# EAGLE design untitled (EAGLE 6.1)
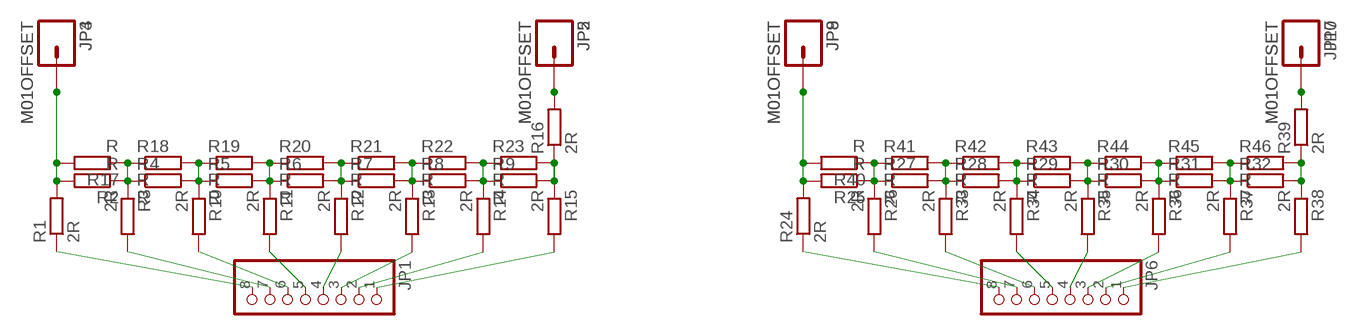
[diagram p0: schematic, sheet 1]

## Parts
JP1  PINHD-1X8/90  [1X08/90]
JP2  M01OFFSET  [1X01_OFFSET]
JP3  M01OFFSET  [1X01_OFFSET]
JP4  M01OFFSET  [1X01_OFFSET]
JP5  M01OFFSET  [1X01_OFFSET]
JP6  PINHD-1X8/90  [1X08/90]
JP7  M01OFFSET  [1X01_OFFSET]
JP8  M01OFFSET  [1X01_OFFSET]
JP9  M01OFFSET  [1X01_OFFSET]
JP10  M01OFFSET  [1X01_OFFSET]
R1  2R  R-EU_M0805  [M0805]
R2  R  R-EU_M0805  [M0805]
R3  2R  R-EU_M0805  [M0805]
R4  R  R-EU_M0805  [M0805]
R5  R  R-EU_M0805  [M0805]
R6  R  R-EU_M0805  [M0805]
R7  R  R-EU_M0805  [M0805]
R8  R  R-EU_M0805  [M0805]
R9  R  R-EU_M0805  [M0805]
R10  2R  R-EU_M0805  [M0805]
R11  2R  R-EU_M0805  [M0805]
R12  2R  R-EU_M0805  [M0805]
R13  2R  R-EU_M0805  [M0805]
R14  2R  R-EU_M0805  [M0805]
R15  2R  R-EU_M0805  [M0805]
R16  2R  R-EU_M0805  [M0805]
R17  R  R-EU_M0805  [M0805]
R18  R  R-EU_M0805  [M0805]
R19  R  R-EU_M0805  [M0805]
R20  R  R-EU_M0805  [M0805]
R21  R  R-EU_M0805  [M0805]
R22  R  R-EU_M0805  [M0805]
R23  R  R-EU_M0805  [M0805]
R24  2R  R-EU_0204/2V  [0204V]
R25  R  R-EU_0204/2V  [0204V]
R26  2R  R-EU_0204/2V  [0204V]
R27  R  R-EU_0204/2V  [0204V]
R28  R  R-EU_0204/2V  [0204V]
R29  R  R-EU_0204/2V  [0204V]
R30  R  R-EU_0204/2V  [0204V]
R31  R  R-EU_0204/2V  [0204V]
R32  R  R-EU_0204/2V  [0204V]
R33  2R  R-EU_0204/2V  [0204V]
R34  2R  R-EU_0204/2V  [0204V]
R35  2R  R-EU_0204/2V  [0204V]
R36  2R  R-EU_0204/2V  [0204V]
R37  2R  R-EU_0204/2V  [0204V]
R38  2R  R-EU_0204/2V  [0204V]
R39  2R  R-EU_0204/2V  [0204V]
R40  R  R-EU_0204/2V  [0204V]
R41  R  R-EU_0204/2V  [0204V]
R42  R  R-EU_0204/2V  [0204V]
R43  R  R-EU_0204/2V  [0204V]
R44  R  R-EU_0204/2V  [0204V]
R45  R  R-EU_0204/2V  [0204V]
R46  R  R-EU_0204/2V  [0204V]

## Nets
N$1: R2.1 R3.1 R4.1
N$2: R4.2 R5.1 R10.1
N$3: R5.2 R6.1 R11.1
N$4: R6.2 R7.1 R12.1
N$5: R8.2 R9.1 R14.1
N$6: R7.2 R8.1 R13.1
N$7: JP3.1 JP4.1 R1.2 R2.2 R17.2
N$8: JP1.8 R1.1
N$9: JP1.7 R3.2
N$10: JP1.6 R10.2
N$11: JP1.5 R11.2
N$12: JP1.4 R12.2
N$13: JP1.3 R13.2
N$14: JP1.2 R14.2
N$15: R9.2 R15.1 R16.1
N$16: JP1.1 R15.2
N$17: JP2.1 JP5.1 R16.2
N$18: R25.1 R26.1 R27.1
N$19: R27.2 R28.1 R33.1
N$20: R28.2 R29.1 R34.1
N$21: R29.2 R30.1 R35.1
N$22: R31.2 R32.1 R37.1
N$23: R30.2 R31.1 R36.1
N$24: JP8.1 JP9.1 R24.2 R25.2 R40.2
N$25: JP6.8 R24.1
N$26: R17.1 R18.1
N$27: R18.2 R19.1
N$28: R19.2 R20.1
N$29: R20.2 R21.1
N$30: R22.2 R23.1
N$31: R21.2 R22.1
N$32: JP6.7 R26.2
N$33: R23.2
N$34: JP6.6 R33.2
N$35: JP6.5 R34.2
N$36: JP6.4 R35.2
N$37: JP6.3 R36.2
N$38: JP6.2 R37.2
N$39: R32.2 R38.1 R39.1 R46.2
N$40: JP6.1 R38.2
N$41: JP7.1 JP10.1 R39.2
N$42: R40.1 R41.1
N$43: R41.2 R42.1
N$44: R42.2 R43.1
N$45: R43.2 R44.1
N$46: R45.2 R46.1
N$47: R44.2 R45.1

## Library data of the parts
JP1 JP6 = pinhead:PINHD-1X8: PIN HEADER
JP2-JP5 JP7-JP10 = SparkFun-Connectors:M01: Header 1 Standard 1-pin 0.1" header. Use with straight break away headers (SKU : PRT-00116), right angle break away headers (PRT-00553), swiss pins (PRT-00743), machine pins (PRT-00117), and female headers (PRT-00115).
R1-R46 = rcl:R-EU_: RESISTOR, European symbol

## Board
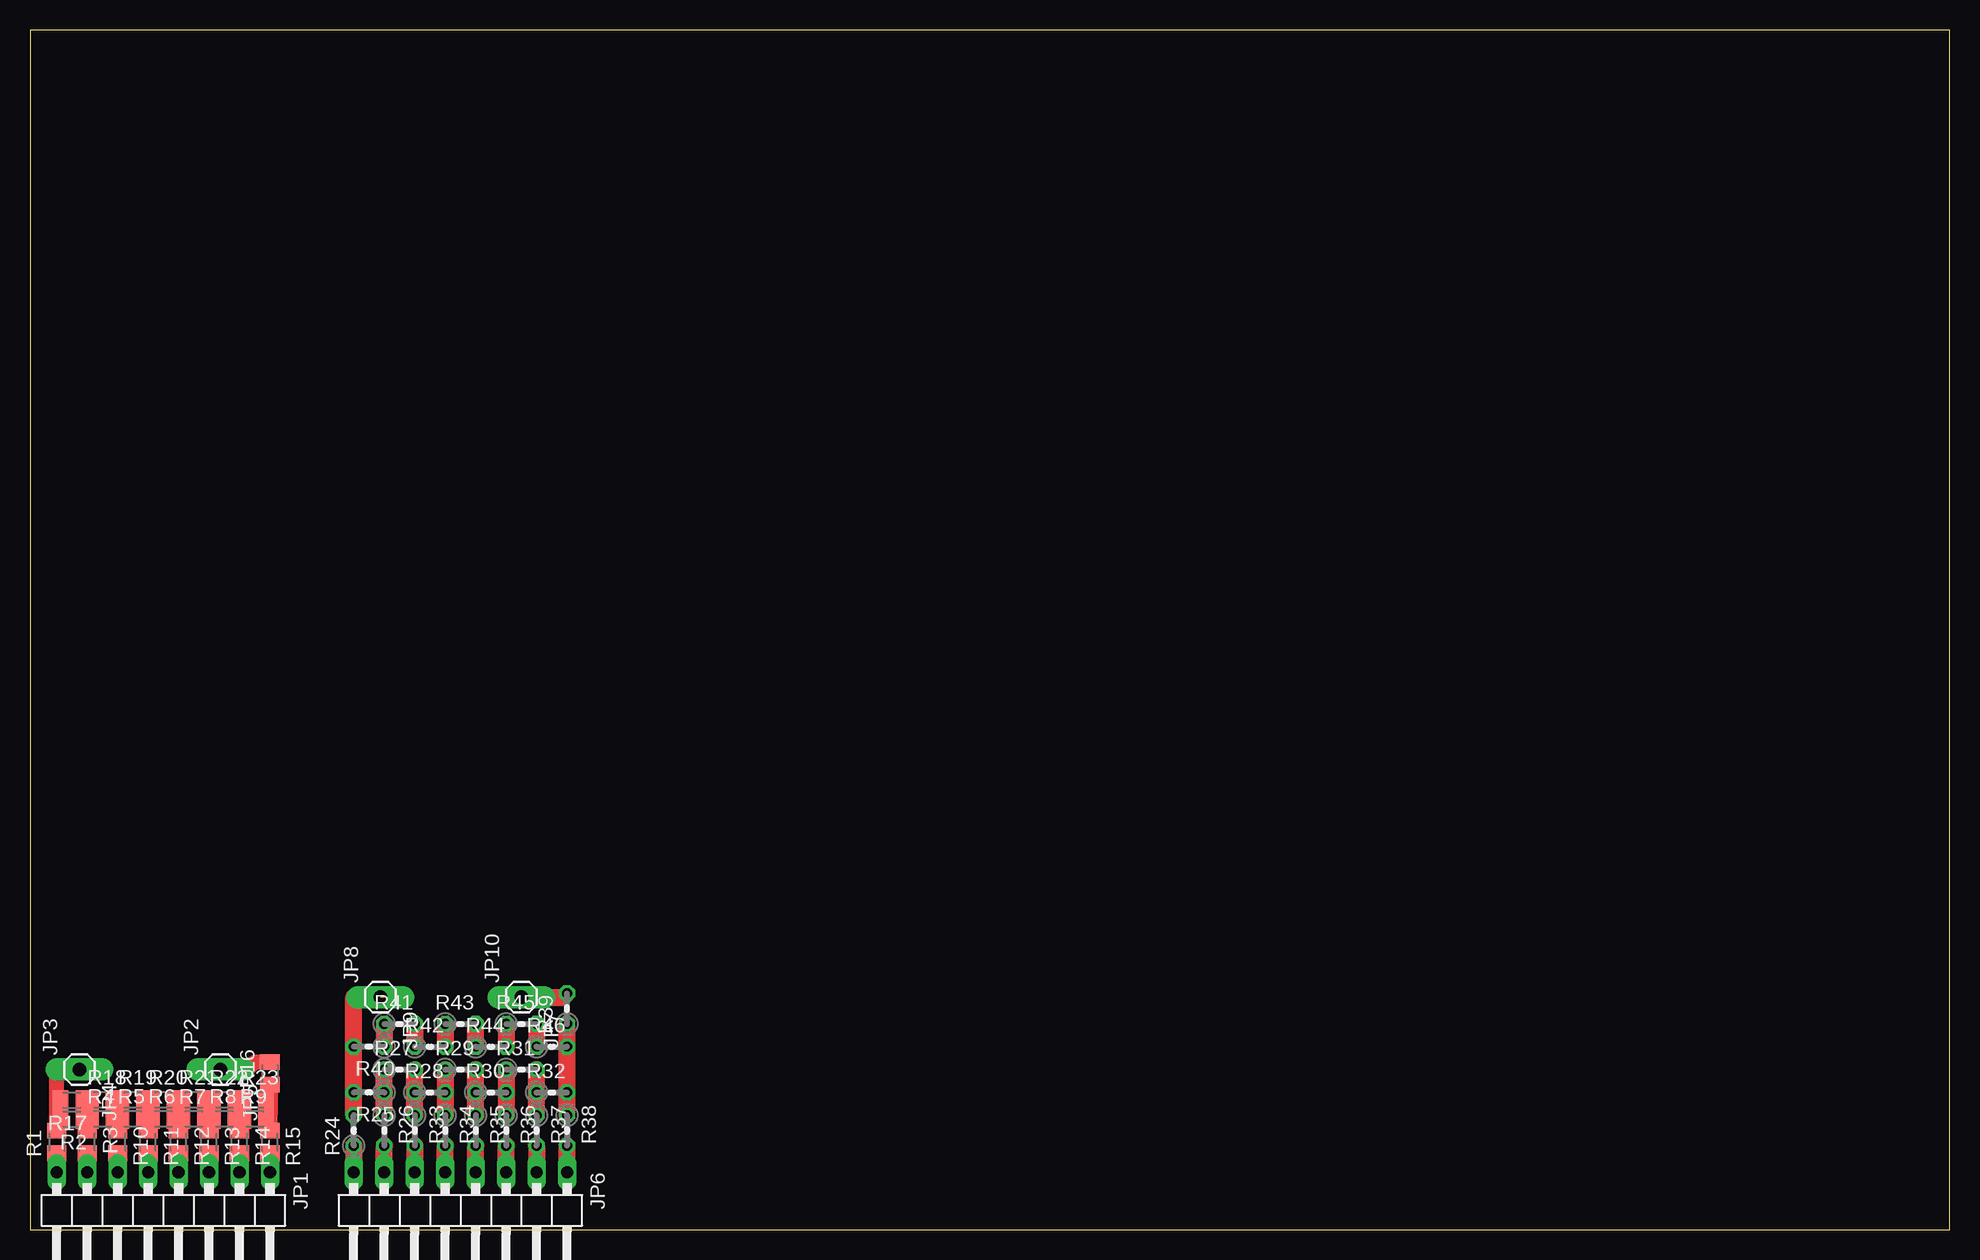
[diagram p1: board, top side]

Size 160 x 100 mm. Coordinates in mm from the lower left corner, seen from the top.
Outline: 0,0 160,0 160,100 0,100 0,0
Copper layers (1*16): Top 0.035mm / dielectric 1.5mm / Bottom 0.035mm
Design rules: minimum track width 10mil, minimum drill 24mil, track to track 8mil, track to pad 8mil, pad to pad 8mil, via to via 8mil, smd to smd 8mil, copper to edge 40mil, drill to drill 8mil, minimum pad ring 10mil, minimum via ring 8mil, stop-mask expansion 4mil, vias tented up to drill 0mil, thermal gap 10mil

### Footprints (pad centres in the part's own frame; a part is rotated, then mirrored left to right if it is on the bottom)
1X08/90 = drill 1.016 long: 1 -8.89,-3.81; 2 -6.35,-3.81; 3 -3.81,-3.81; 4 -1.27,-3.81; 5 1.27,-3.81; 6 3.81,-3.81; 7 6.35,-3.81; 8 8.89,-3.81
1X01_OFFSET = drill 1.118 pad 1.88 offset: 1 0,0
M0805 = smd 1.3 x 1.6: 1 -0.95,0; 2 0.95,0
0204V = drill 0.813 octagon: 1 -1.27,0; 2 1.27,0

### Placement (x,y rotation side)
JP1  11.11,0.95 180 top
JP2  15.88,13.34 90 top
JP3  4.13,13.34 90 top
JP4  4.13,13.34 270 top
JP5  15.88,13.34 270 top
JP6  35.88,0.95 180 top
JP7  40.96,19.37 270 top
JP8  29.21,19.37 90 top
JP9  29.21,19.37 270 top
JP10  40.96,19.37 90 top
R1  2.22,7.3 90 top
R2  3.49,9.21 180 top
R3  4.76,7.3 270 top
R4  6.03,9.21 0 top
R5  8.57,9.21 0 top
R6  11.11,9.21 0 top
R7  13.65,9.21 0 top
R8  16.19,9.21 0 top
R9  18.73,9.21 0 top
R10  7.3,7.3 270 top
R11  9.84,7.3 270 top
R12  12.38,7.3 270 top
R13  14.92,7.3 270 top
R14  17.46,7.3 270 top
R15  20,7.3 270 top
R16  20,13.02 90 top
R17  3.49,10.79 180 top
R18  6.03,10.79 0 top
R19  8.57,10.79 0 top
R20  11.11,10.79 0 top
R21  13.65,10.79 0 top
R22  16.19,10.79 0 top
R23  18.73,10.79 0 top
R24  26.99,8.26 90 top
R25  28.26,11.43 180 top
R26  29.53,8.26 270 top
R27  30.8,13.34 0 top
R28  33.34,11.43 0 top
R29  35.88,13.34 0 top
R30  38.42,11.43 0 top
R31  40.96,13.34 0 top
R32  43.5,11.43 0 top
R33  32.07,8.26 270 top
R34  34.61,8.26 270 top
R35  37.15,8.26 270 top
R36  39.69,8.26 270 top
R37  42.23,8.26 270 top
R38  44.77,8.26 270 top
R39  44.77,18.41 90 top
R40  28.26,15.24 180 top
R41  30.8,17.14 0 top
R42  33.34,15.24 0 top
R43  35.88,17.14 0 top
R44  38.42,15.24 0 top
R45  40.96,17.14 0 top
R46  43.5,15.24 0 top

### Tracks (layer width: path | path; a pad name or v marks a point on that pad's centre or on a via)
N$1
  Top 1.27: R3.1 4.76,8.89 R2.1 R4.1
N$2
  Top 1.27: R4.2 R5.1 7.3,8.89 R10.1
N$3
  Top 1.27: R11.1 9.84,8.89 R6.1 R5.2
N$4
  Top 1.27: R12.1 12.38,8.89 | 12.38,8.89 R6.2 | 12.38,8.89 R7.1
N$5
  Top 1.27: R14.1 17.46,8.89 R9.1 R8.2
N$6
  Top 1.27: R13.1 14.92,8.89 | 14.92,8.89 R7.2 | 14.92,8.89 R8.1
N$7  (1 unrouted)
  Top 1.27: R2.2 2.22,8.89 R1.2 2.22,12.7 2.86,13.34 JP4.1 | R17.2 R2.2
N$8
  Top 1.27: R1.1 JP1.8
N$9
  Top 1.27: R3.2 JP1.7
N$10
  Top 1.27: JP1.6 R10.2
N$11
  Top 1.27: JP1.5 R11.2
N$12
  Top 1.27: JP1.4 R12.2
N$13
  Top 1.27: JP1.3 R13.2
N$14
  Top 1.27: JP1.2 R14.2
N$15
  Top 1.27: R15.1 R16.1 20,9.53 R9.2
N$16  (1 unrouted)
  Top 1.27: JP1.1 R15.2
N$17
  Top 1.27: JP5.1 18.1,13.34 18.73,13.97 R16.2
N$18
  Top 1.422: R26.1 R25.1 R27.1
N$19
  Top 1.422: R33.1 R28.1 R27.2
N$20
  Top 1.422: R29.1 R28.2 R34.1
N$21
  Top 1.422: R35.1 R30.1 R29.2
N$22
  Top 1.422: R37.1 R32.1 R31.2
N$23
  Top 1.422: R31.1 R30.2 R36.1
N$24  (1 unrouted)
  Top 1.422: R24.2 R25.2 R40.2 26.99,19.37 29.53,19.37
N$25
  Top 1.422: R24.1 JP6.8
N$26  (1 unrouted)
  Top 1.27: R17.1 R18.1
N$27
  Top 1.27: R18.2 R19.1
N$28
  Top 1.27: R19.2 R20.1
N$29
  Top 1.27: R20.2 R21.1
N$30
  Top 1.27: R22.2 R23.1
N$31
  Top 1.27: R21.2 R22.1
N$32
  Top 1.422: JP6.7 R26.2
N$34
  Top 1.422: R33.2 JP6.6
N$35
  Top 1.422: JP6.5 R34.2
N$36
  Top 1.422: JP6.4 R35.2
N$37
  Top 1.422: JP6.3 R36.2
N$38
  Top 1.422: R37.2 JP6.2
N$39
  Top 1.422: R38.1 R32.2 R46.2 R39.1
N$40
  Top 1.422: JP6.1 R38.2
N$41
  Top 1.422: JP10.1 44.45,19.37 R39.2
N$42
  Top 1.422: R41.1 R40.1
N$43
  Top 1.422: R41.2 R42.1
N$44
  Top 1.422: R43.1 R42.2
N$45
  Top 1.422: R44.1 R43.2
N$46
  Top 1.422: R45.2 R46.1
N$47
  Top 1.422: R45.1 R44.2